# EAGLE design battery_monitor_6803-2_Rev6 (EAGLE 7.3.0)
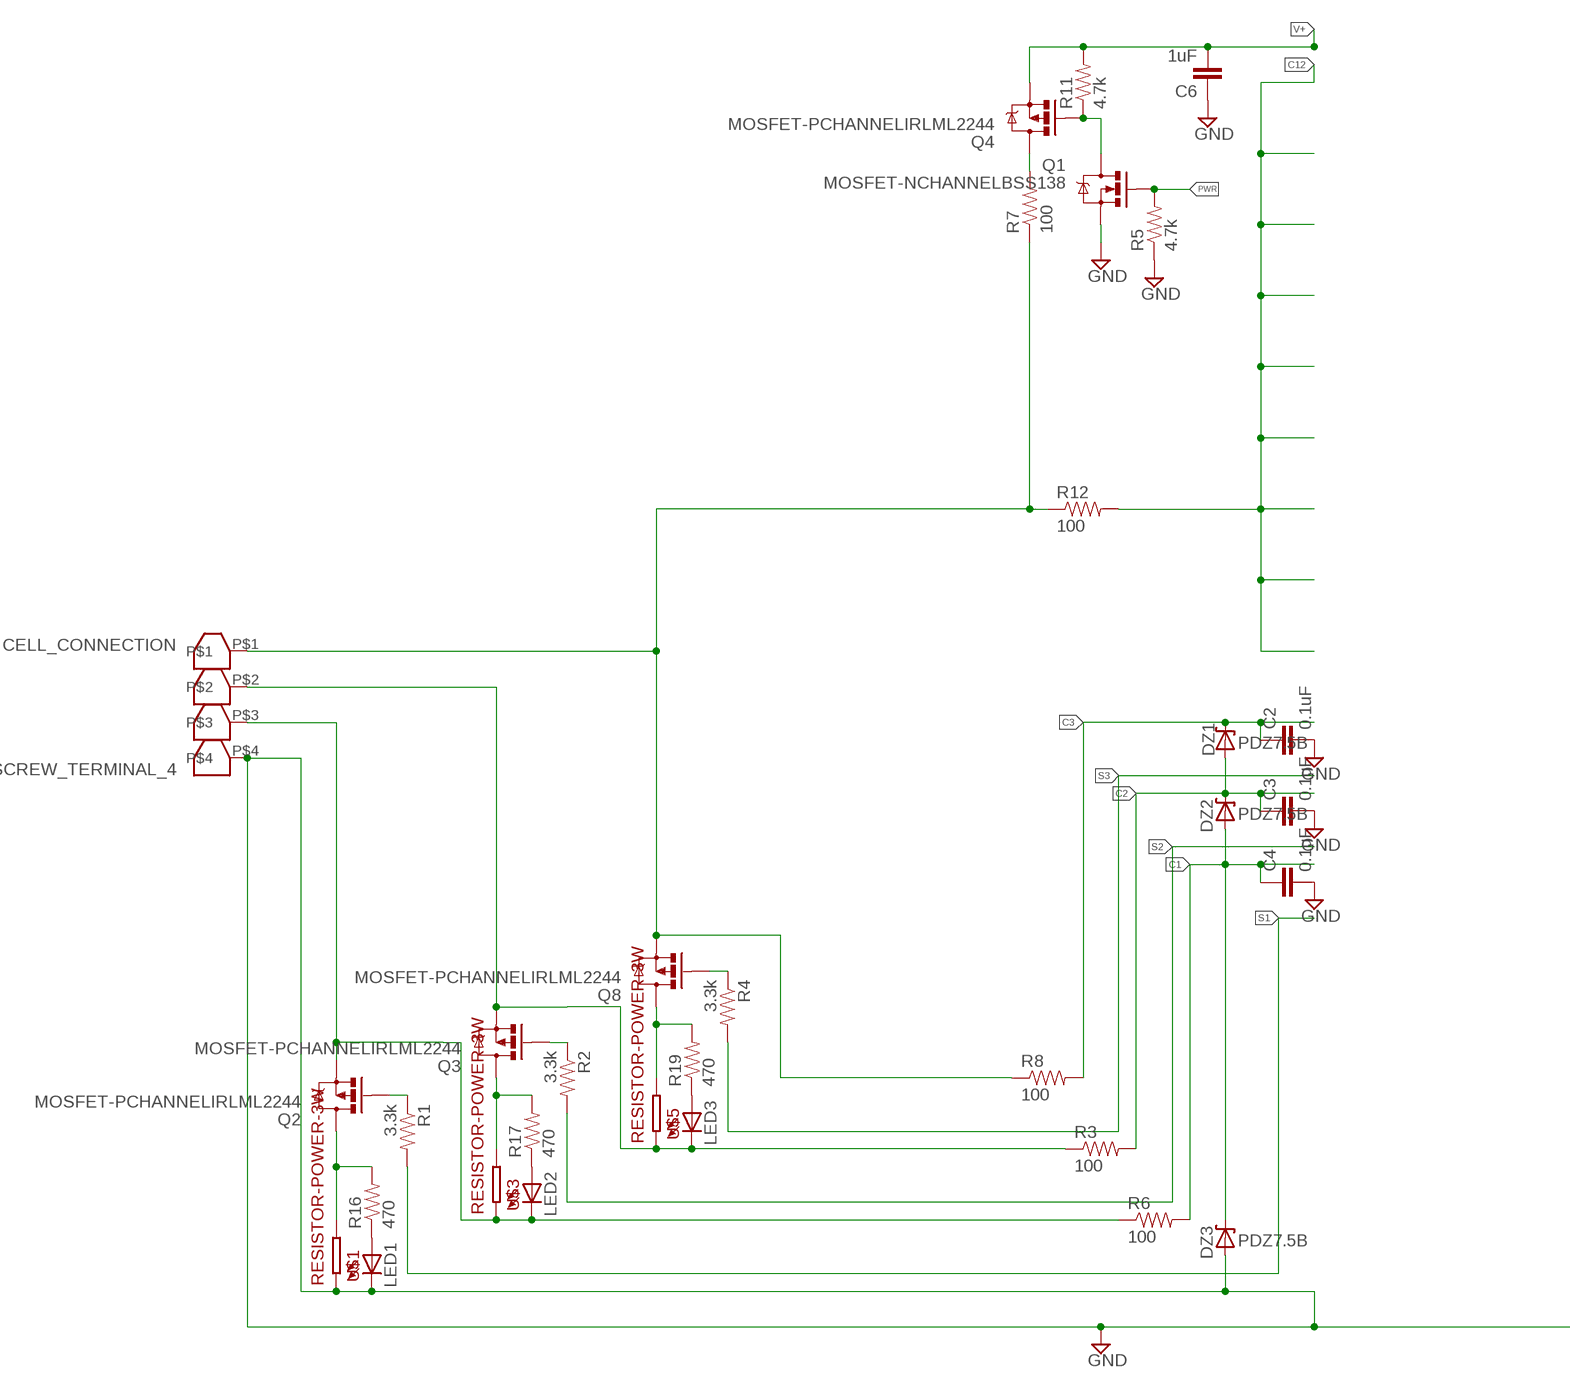
[diagram p0: schematic, sheet 1, part 1 of 2]
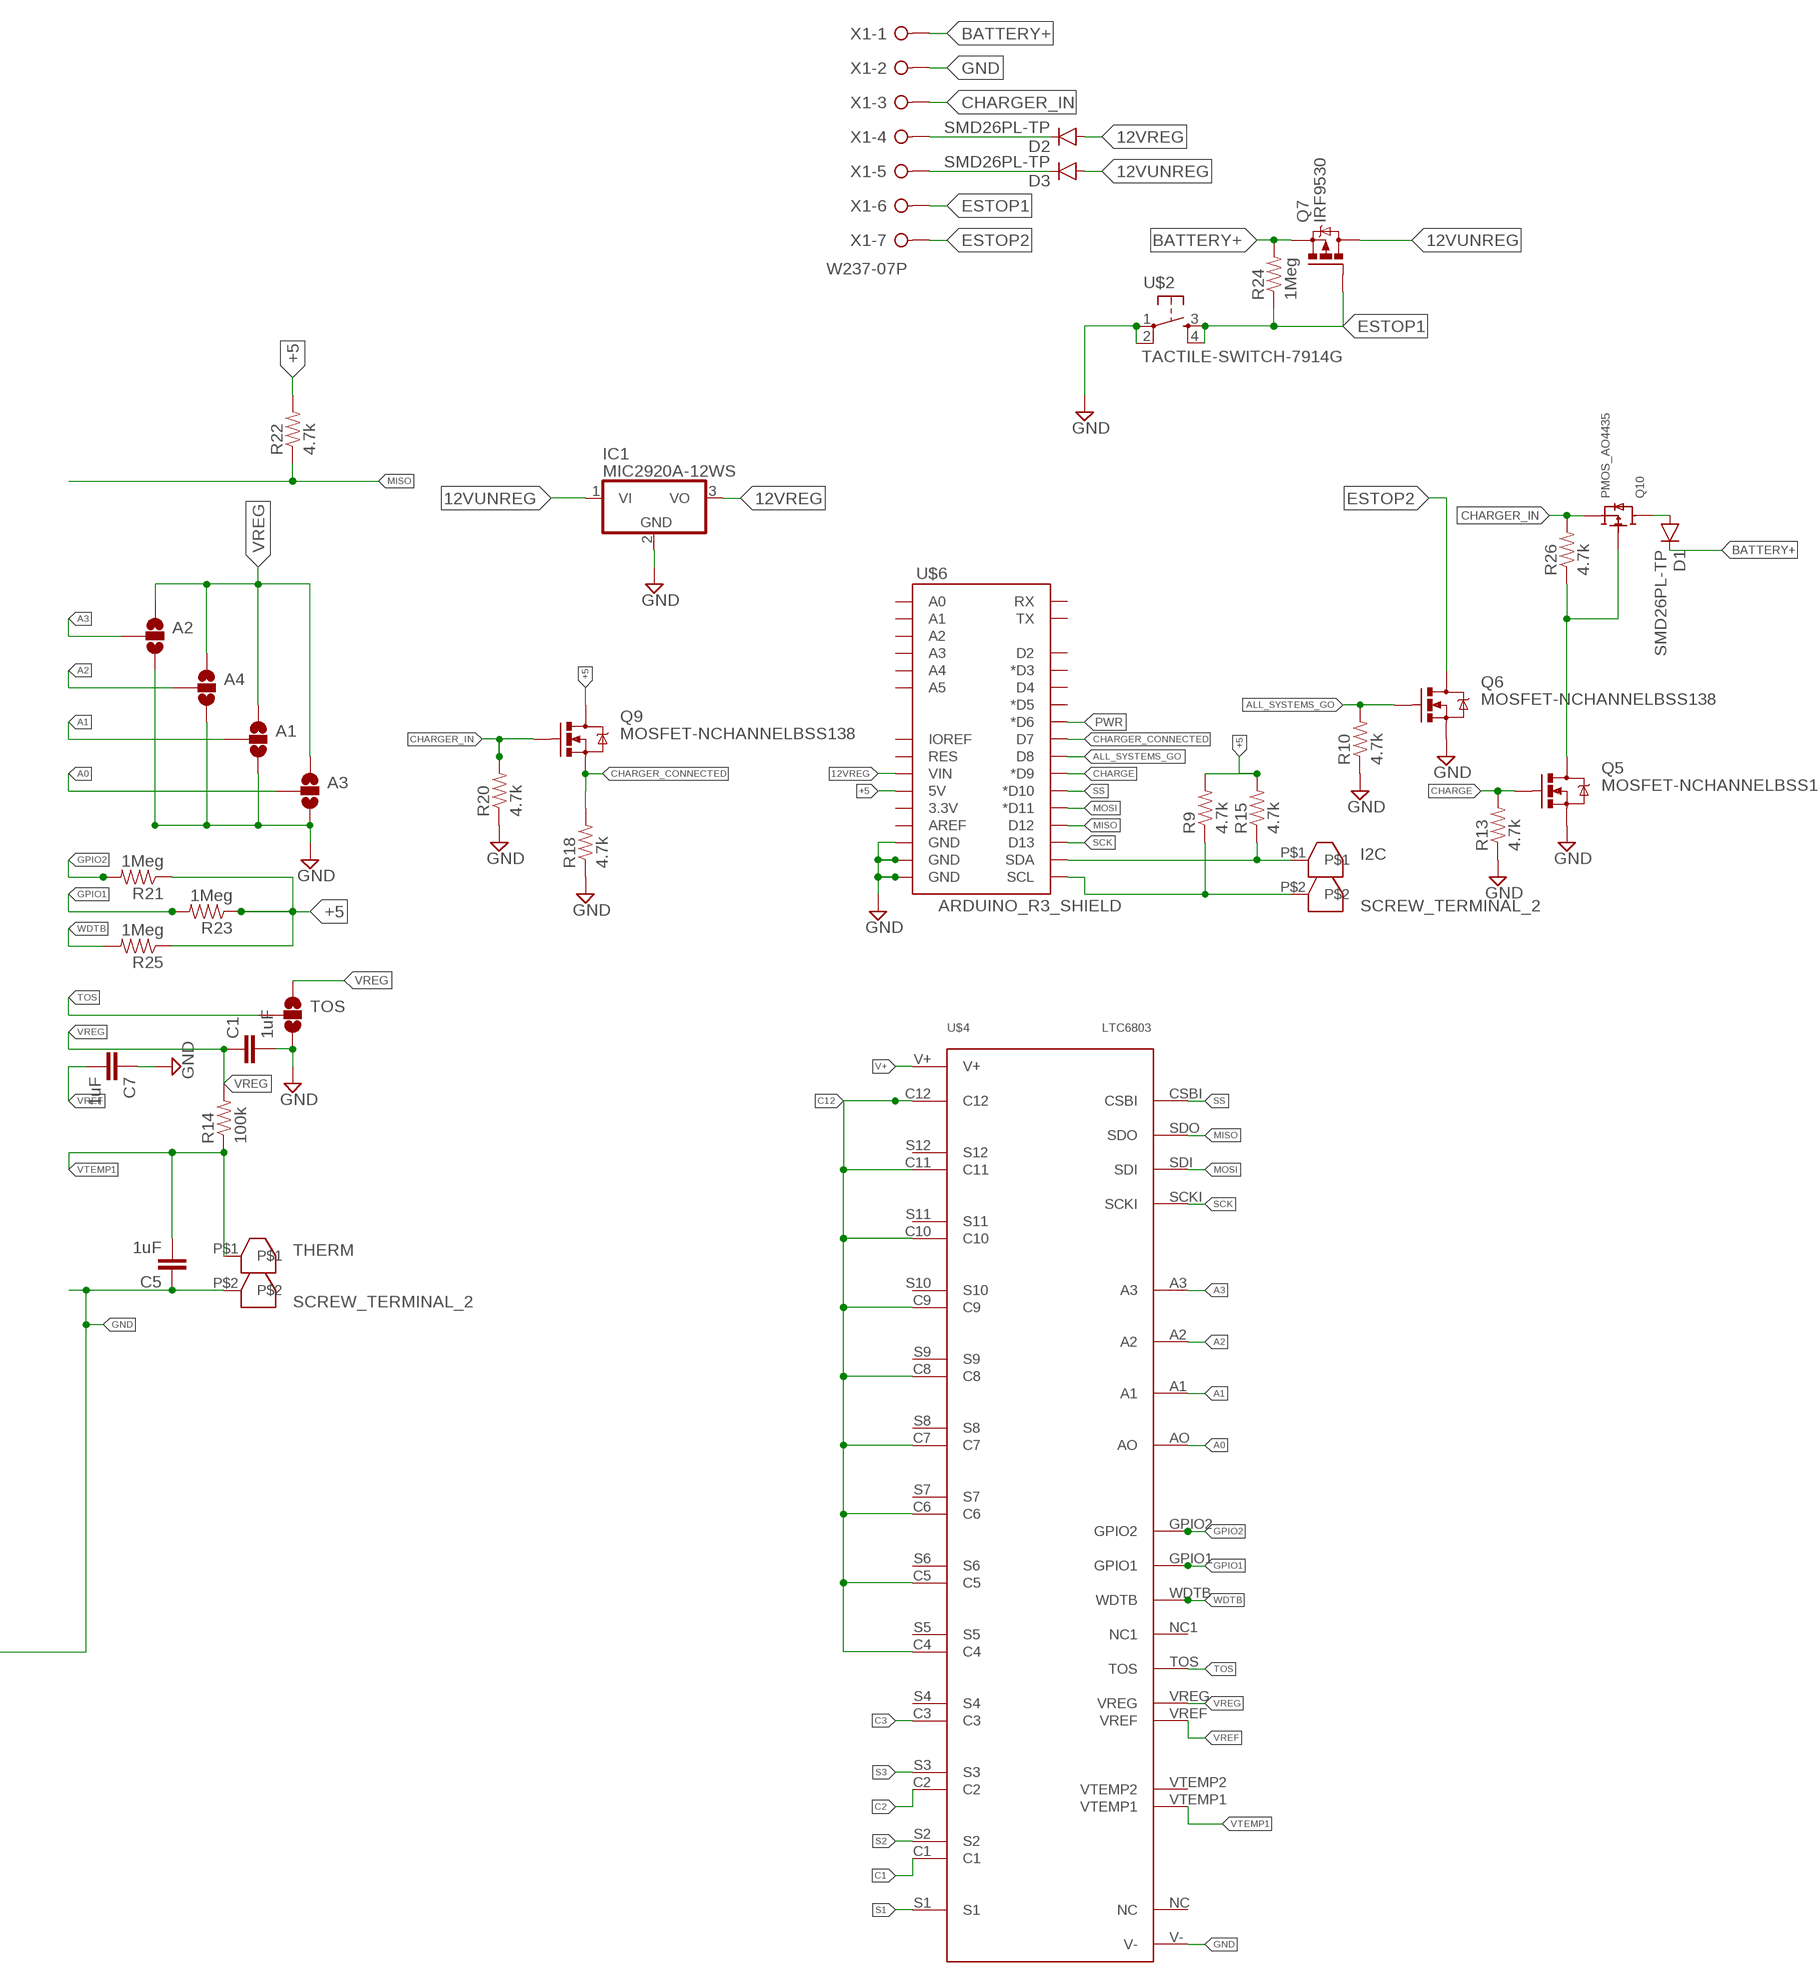
[diagram p1: schematic, sheet 1, part 2 of 2]

## Parts
A1  SOLDERJUMPER_2WAYS  [SJ_3]
A2  SOLDERJUMPER_2WAYS  [SJ_3]
A3  SOLDERJUMPER_2WAYS  [SJ_3]
A4  SOLDERJUMPER_2WAYS  [SJ_3]
C1  1uF  0.1UF-100V-10%(0603)  [0603-CAP]
C2  0.1uF  0.1UF-100V-10%(0603)  [0603-CAP]
C3  0.1uF  0.1UF-100V-10%(0603)  [0603-CAP]
C4  0.1uF  0.1UF-100V-10%(0603)  [0603-CAP]
C5  1uF  0.1UF-100V-10%(0603)  [0603-CAP]
C6  1uF  0.1UF-100V-10%(0603)  [0603-CAP]
C7  1uF  0.1UF-100V-10%(0603)  [0603-CAP]
CELL_CONNECTION  SCREW_TERMINAL_4  [SCREW_TERMINAL_4]
D1  SMD26PL-TP  DIODESOD123  [SOD-123]
D2  SMD26PL-TP  DIODESOD123  [SOD-123]
D3  SMD26PL-TP  DIODESOD123  [SOD-123]
DZ1  PDZ7.5B  DIODE-ZENER-BZT52  [SOD-323@1]
DZ2  PDZ7.5B  DIODE-ZENER-BZT52  [SOD-323@1]
DZ3  PDZ7.5B  DIODE-ZENER-BZT52  [SOD-323@1]
I2C  SCREW_TERMINAL_2  [SCREW_TERMINAL_2]
IC1  MIC2920A-12WS  MCP1703DB  [SOT223]
LED1  LED0603  [LED-0603]
LED2  LED0603  [LED-0603]
LED3  LED0603  [LED-0603]
Q1  MOSFET-NCHANNELBSS138  [SOT23]
Q2  MOSFET-PCHANNELIRLML2244  [SOT23-3@1]
Q3  MOSFET-PCHANNELIRLML2244  [SOT23-3@1]
Q4  MOSFET-PCHANNELIRLML2244  [SOT23-3@1]
Q5  MOSFET-NCHANNELBSS138  [SOT23]
Q6  MOSFET-NCHANNELBSS138  [SOT23]
Q7  IRF9530  [TO220BV]
Q8  MOSFET-PCHANNELIRLML2244  [SOT23-3@1]
Q9  MOSFET-NCHANNELBSS138  [SOT23]
Q10  PMOS_AO4435  [SOIC8]
R1  3.3k  3.3KOHM1/10W1%(0603)  [0603-RES]
R2  3.3k  3.3KOHM1/10W1%(0603)  [0603-RES]
R3  100  3.3KOHM1/10W1%(0603)  [0603-RES]
R4  3.3k  3.3KOHM1/10W1%(0603)  [0603-RES]
R5  4.7k  3.3KOHM1/10W1%(0603)  [0603-RES]
R6  100  3.3KOHM1/10W1%(0603)  [0603-RES]
R7  100  3.3KOHM1/10W1%(0603)  [0603-RES]
R8  100  3.3KOHM1/10W1%(0603)  [0603-RES]
R9  4.7k  3.3KOHM1/10W1%(0603)  [0603-RES]
R10  4.7k  3.3KOHM1/10W1%(0603)  [0603-RES]
R11  4.7k  3.3KOHM1/10W1%(0603)  [0603-RES]
R12  100  3.3KOHM1/10W1%(0603)  [0603-RES]
R13  4.7k  3.3KOHM1/10W1%(0603)  [0603-RES]
R14  100k  3.3KOHM1/10W1%(0603)  [0603-RES]
R15  4.7k  3.3KOHM1/10W1%(0603)  [0603-RES]
R16  470  3.3KOHM1/10W1%(0603)  [0603-RES]
R17  470  3.3KOHM1/10W1%(0603)  [0603-RES]
R18  4.7k  3.3KOHM1/10W1%(0603)  [0603-RES]
R19  470  3.3KOHM1/10W1%(0603)  [0603-RES]
R20  4.7k  3.3KOHM1/10W1%(0603)  [0603-RES]
R21  1Meg  3.3KOHM1/10W1%(0603)  [0603-RES]
R22  4.7k  3.3KOHM1/10W1%(0603)  [0603-RES]
R23  1Meg  3.3KOHM1/10W1%(0603)  [0603-RES]
R24  1Meg  3.3KOHM1/10W1%(0603)  [0603-RES]
R25  1Meg  3.3KOHM1/10W1%(0603)  [0603-RES]
R26  4.7k  3.3KOHM1/10W1%(0603)  [0603-RES]
THERM  SCREW_TERMINAL_2  [SCREW_TERMINAL_2]
TOS  SOLDERJUMPER_2WAYS  [SJ_3]
U$1  RESISTOR-POWER-3W  [RESISTOR-3W]
U$2  TACTILE-SWITCH-7914G  [7914G]
U$3  RESISTOR-POWER-3W  [RESISTOR-3W]
U$4  LTC6803  LTC6803_BREAKOUT  [LTC6803_BREAKOUT]
U$5  RESISTOR-POWER-3W  [RESISTOR-3W]
U$6  ARDUINO_R3_SHIELD  [UNO_R3_SHIELD]
X1  W237-07P  [W237-7P]

## Nets
12VREG: D2.A IC1.3(VO) U$6.VIN
12VUNREG: D3.A IC1.1(VI) Q7.D
+5: Q9.3(D) R9.2 R15.2 R21.1 R22.2 R23.1 R25.1 U$6.5V
A0: A3.2 U$4.AO
A1: A1.2 U$4.A1
A2: A4.2 U$4.A2
A3: A2.2 U$4.A3
ALL_SYSTEMS_GO: Q6.1(G) R10.2 U$6.D8
BATTERY+: D1.C Q7.S R24.2 X1.1
C1: C4.1 DZ2.2(A) DZ3.1(C) R6.2 U$4.C1
C2: C3.1 DZ1.2(A) DZ2.1(C) R3.2 U$4.C2
C3: C2.1 DZ1.1(C) R8.2 U$4.C3
C12: R12.2 U$4.C4 U$4.C5 U$4.C6 U$4.C7 U$4.C8 U$4.C9 U$4.C10 U$4.C11 U$4.C12
CHARGE: Q5.1(G) R13.2 U$6.D9(*D9)
CHARGER_CONNECTED: Q9.2(S) R18.2 U$6.D7
CHARGER_IN: Q9.1(G) Q10.1(SOURCE) Q10.2(SOURCE) Q10.3(SOURCE) R20.2 R26.2 X1.3
ESTOP1: Q7.G R24.1 U$2.3 U$2.4 X1.6
ESTOP2: Q6.3(D) X1.7
GND: A1.3 A2.3 A3.3 A4.3 C1.2 C2.2 C3.2 C4.2 C5.1 C6.1 C7.1 CELL_CONNECTION.P$4 DZ3.2(A) IC1.2(GND) LED1.C Q1.2(S) Q5.2(S) Q6.2(S) R5.1 R10.1 R13.1 R18.1 R20.1 THERM.P$2 TOS.3 U$1.P$2 U$2.1 U$2.2 U$4.V- U$6.GND@0(GND) U$6.GND@1(GND) U$6.GND@2(GND) X1.2
GPIO1: R23.2 U$4.GPIO1
GPIO2: R21.2 U$4.GPIO2
MISO: R22.1 U$4.SDO U$6.D12
MOSI: U$4.SDI U$6.D11(*D11)
N$1: Q5.3(D) Q10.4(GATE) R26.1
N$2: CELL_CONNECTION.P$3 LED2.C Q2.2(S) R6.1 U$3.P$2
N$3: CELL_CONNECTION.P$2 LED3.C Q3.2(S) R3.1 U$5.P$2
N$4: CELL_CONNECTION.P$1 Q8.2(S) R7.1 R8.1 R12.1
N$5: Q2.3(D) R16.2 U$1.P$1
N$7: Q2.1(G) R1.1
N$8: D1.A Q10.5(DRAIN) Q10.6(DRAIN) Q10.7(DRAIN) Q10.8(DRAIN)
N$10: Q3.3(D) R17.2 U$3.P$1
N$11: Q3.1(G) R2.1
N$12: Q8.3(D) R19.2 U$5.P$1
N$13: LED1.A R16.1
N$15: D2.C X1.4
N$16: D3.C X1.5
N$18: Q4.3(D) R7.2
N$20: Q1.3(D) Q4.1(G) R11.1
N$22: LED2.A R17.1
N$23: LED3.A R19.1
N$29: Q8.1(G) R4.1
PWR: Q1.1(G) R5.2 U$6.D6(*D6)
S1: R1.2 U$4.S1
S2: R2.2 U$4.S2
S3: R4.2 U$4.S3
SCK: U$4.SCKI U$6.D13
SCL: I2C.P$2 R9.1 U$6.SCL
SDA: I2C.P$1 R15.1 U$6.SDA
SS: U$4.CSBI U$6.D10(*D10)
TOS: TOS.2 U$4.TOS
V+: C6.2 Q4.2(S) R11.2 U$4.V+
VREF: C7.2 U$4.VREF
VREG: A1.1 A2.1 A3.1 A4.1 C1.1 R14.2 TOS.1 U$4.VREG
VTEMP1: C5.2 R14.1 THERM.P$1 U$4.VTEMP1
WDTB: R25.2 U$4.WDTB
Unconnected: U$4.NC U$4.NC1 U$4.S4 U$4.S5 U$4.S6 U$4.S7 U$4.S8 U$4.S9 U$4.S10 U$4.S11 U$4.S12 U$4.VTEMP2 U$6.3.3V U$6.A0 U$6.A1 U$6.A2 U$6.A3 U$6.A4 U$6.A5 U$6.AREF U$6.D2 U$6.D3(*D3) U$6.D4 U$6.D5(*D5) U$6.IOREF U$6.RES U$6.RX U$6.TX

## Library data of the parts
A1-A4 TOS = SparkFun:SOLDERJUMPER_2WAY: Solder Jumper 2 way solder jumper; OC_NEWARK: unknown
C1 C5-C7 = SparkFun-Capacitors:0.1UF-100V-10%(0603): CAP-08390; MPN: C0603X5R0J105M030BC; OC_NEWARK: 04X3184; PROD_ID: CAP-08390; VALUE: 0.1uF
C2-C4 = SparkFun-Capacitors:0.1UF-100V-10%(0603): CAP-08390; MF: AVX CORPORATION; MPN: 0603YG104ZAT2A; OC_NEWARK: 01H6821; PROD_ID: CAP-08390
CELL_CONNECTION = isaac1:SCREW_TERMINAL_4; MF: TYCO ELECTRONICS; MPN: 282834-4; OC_NEWARK: 12H8388
D1-D3 = SparkFun-DiscreteSemi:DIODE: Diode These are standard reverse protection diodes and small signal diodes. SMA package can handle up to about 1A. SOD-323 can handle about 200mA. What the SOD-323 package when ordering, there are some mfgs out there that are 5-pin packages.
DZ1-DZ3 = SparkFun-DiscreteSemi:DIODE-ZENER: Zener Diode Production Part - 8199 3.4V Zener Voltage; MPN: PDZ7.5B,115; OC_NEWARK: 04X4941
I2C THERM = isaac1:SCREW_TERMINAL_2; MF: TYCO ELECTRONICS; MPN: 282834-2; OC_NEWARK: 12H8386
IC1 = linear:MCP1703: 250 mA, 16V, Low Quiescent Current LDO Regulator Source: http://ww1.microchip.com/downloads/en/DeviceDoc/22049b.pdf
LED1-LED3 = SparkFun-LED:LED: LEDs Standard schematic elements and footprints for 5mm, 3mm, 1206, and 0603 sized LEDs. 5mm - Spark Fun Electronics SKU : COM-00529 (and others); MPN: 150060RS75000; OC_NEWARK: 95W3795
Q1 Q5 Q6 Q9 = SparkFun-DiscreteSemi:MOSFET-NCHANNEL: Common NMOSFET Parts MFG P/N Store ID Prod ID FDD8780 TRANS-09984 SI7820DN TRANS-11055 FDS6630A IC-08089 2N7002PW TRANS-11151 FQP30N06L COM-10213 TRANS-10060 BSS123LT1G TRANS-08345 BSS138 TRANS-00830 BS170 2N7000; MPN: IRLML0030TRPBF; OC_NEWARK: 52R2613; PROD_ID: TRANS-00830
Q2-Q4 Q8 = SparkFun-DiscreteSemi:MOSFET-PCHANNEL: Generic PMOSFET; MPN: IRLML2244TRPBF; OC_NEWARK: 40T7448; PROD_ID: TRANS-11153
Q7 = Adams Chips:IRF9530: P-CHANNEL HEXFET POWER-MOS-FET Source: http://www.irf.com/product-info/datasheets/data/irf9530.pdf; MPN: NTE2383; OC_NEWARK: 14T4215
Q10 = isaac1:PMOS_AO4435; MPN: SI9407BDY-T1-GE3; OC_NEWARK: 16P3885
R1 R2 R4 = SparkFun-Resistors:3.3KOHM1/10W1%(0603): RES-07851; MF: VISHAY/DALE; MPN: CRCW06033K00FKEA; OC_NEWARK: 52K8368; PROD_ID: RES-07851
R3 R6-R8 R12 = SparkFun-Resistors:3.3KOHM1/10W1%(0603): RES-07851; MPN: ERJ-1GNF1000C; OC_NEWARK: 05X8794; PROD_ID: RES-07851
R5 R9-R11 R13 R15 R18 R20 R22 R26 = SparkFun-Resistors:3.3KOHM1/10W1%(0603): RES-07851; MF: VISHAY/DALE; MPN: CRCW06034K70FKEA; OC_NEWARK: 52K8494; PROD_ID: RES-07851
R14 = SparkFun-Resistors:3.3KOHM1/10W1%(0603): RES-07851; MF: FARNELL; MPN: MC0063W06035100K; OC_NEWARK: 39K0075; PROD_ID: RES-07851
R16 R17 R19 = SparkFun-Resistors:3.3KOHM1/10W1%(0603): RES-07851; MPN: ERJ-P03F4700V; OC_NEWARK: 05X8640; PROD_ID: RES-07851
R21 R23-R25 = SparkFun-Resistors:3.3KOHM1/10W1%(0603): RES-07851; MPN: ERJ-3EKF1004V; OC_NEWARK: 64R5311; PROD_ID: RES-07851
U$1 U$3 U$5 = isaac1:RESISTOR-POWER-3W: PR03 series .205" dia x .657" L; MPN: ERG-3SJ200; OC_NEWARK: 52W7905
U$2 = GeekAmmo:TACTILE-SWITCH: Tactile Switch 4 Pins, SPST NO; MF: BOURNS, INC.; MPN: 7914G-1-000E; OC_NEWARK: 05B2757
U$4 = Clayton:LTC6803_BREAKOUT; MPN: LTC6803IG-2#PBF; OC_NEWARK: 27T5837
U$6 = SparkFun-Boards:ARDUINO_R3_SHIELD: Shield form compatible with the Arduino Uno R3.; OC_NEWARK: unknown
X1 = con-wago-508:W237-07P: WAGO SREW CLAMP; OC_FARNELL: unknown; OC_NEWARK: unknown

## Board
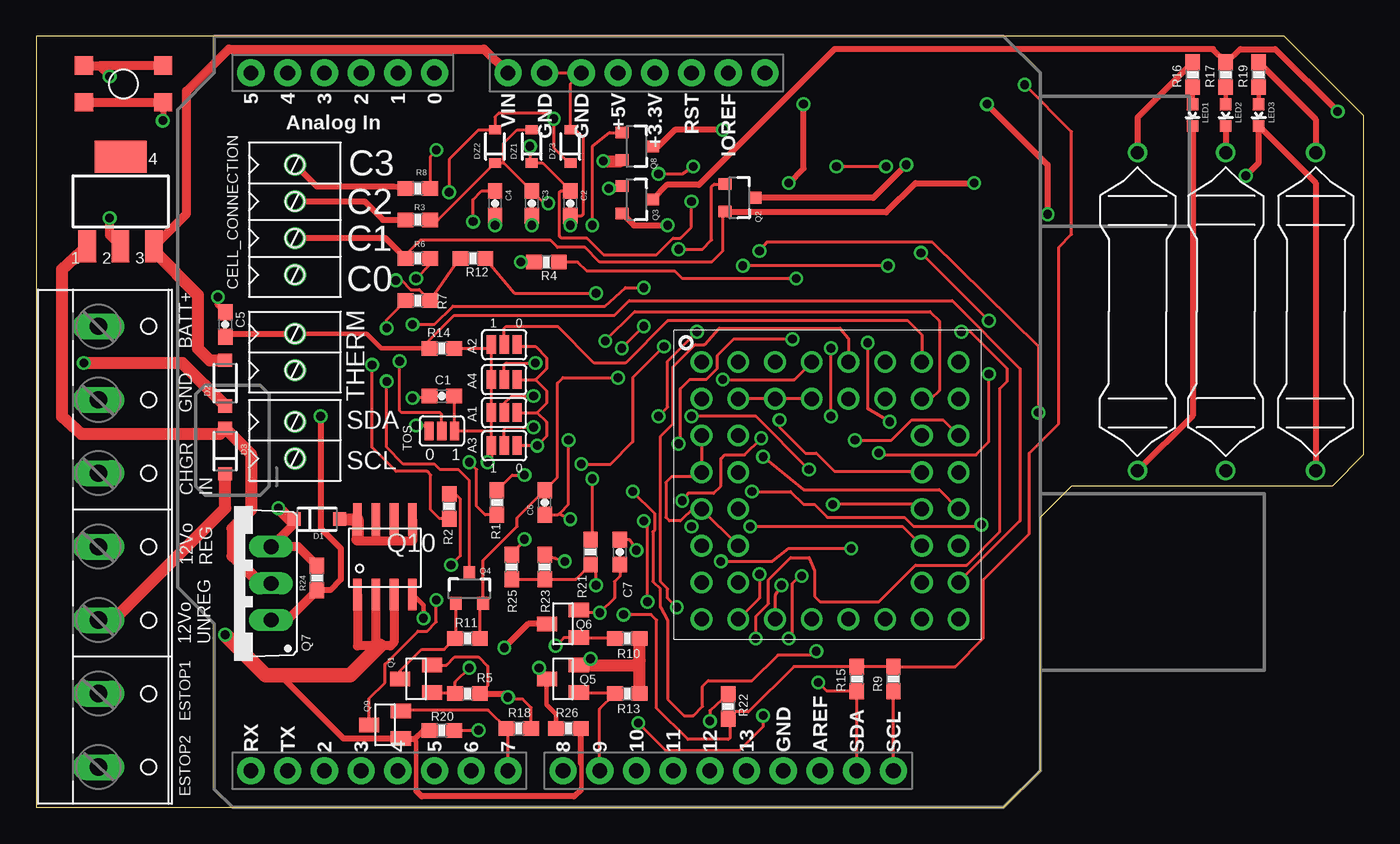
[diagram p2: board, top side]
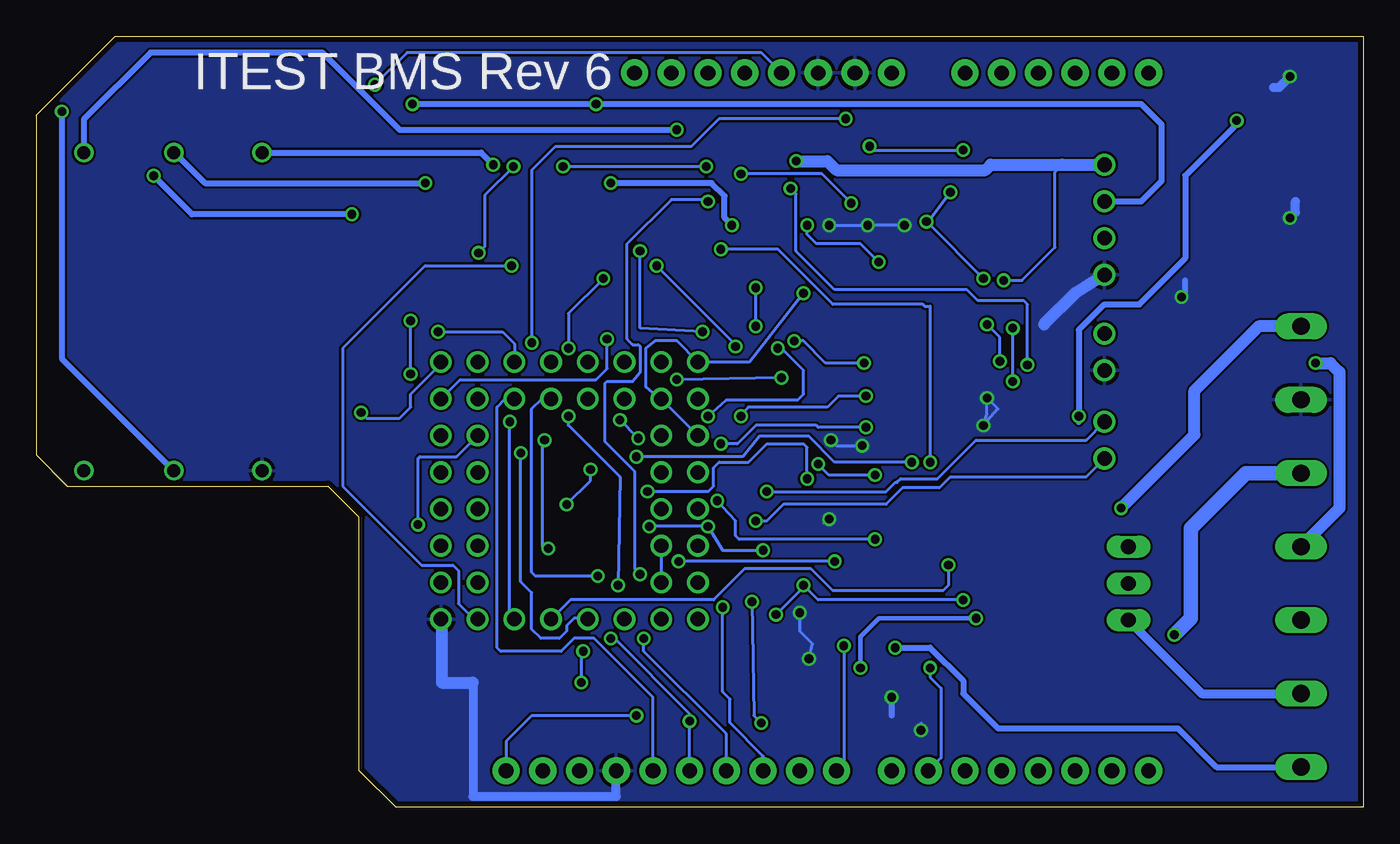
[diagram p3: board, bottom side, seen from below]

Size 91.82 x 53.34 mm. Coordinates in mm from the lower left corner, seen from the top.
Outline: 0,0 66.93,0 69.47,2.54 69.47,20.07 71.63,22.22 89.66,22.22 91.82,24.38 91.82,47.88 86.36,53.34 0,53.34 0,0
Copper layers (1*16): Top 0.0356mm / dielectric 1.5011mm / Bottom 0.0356mm
Design rules "LaenPCBOrder": minimum track width 6mil, minimum drill 13mil, track to track 6mil, track to pad 6mil, pad to pad 6mil, via to via 6mil, smd to smd 6mil, copper to edge 15mil, drill to drill 6mil, minimum pad ring 7mil, minimum via ring 7mil, stop-mask expansion 3mil, vias tented up to drill 0mil, thermal gap 10mil

### Footprints (pad centres in the part's own frame; a part is rotated, then mirrored left to right if it is on the bottom)
SJ_3 = smd 0.635 x 1.27: 1 -0.889,0; 2 0,0; 3 0.889,0
0603-CAP = smd 1.1 x 1: 1 -0.85,0; 2 0.85,0
SCREW_TERMINAL_4 = drill 1.016 pad 1.422: P$1 0,3.81; P$2 0,1.27; P$3 0,-1.27; P$4 0,-3.81
SOD-123 = smd 0.9 x 0.95: A 1.575,0; C -1.575,0
SOD-323@1 = smd 0.63 x 0.83: 1 -1.15,0; 2 1.15,0
SCREW_TERMINAL_2 = drill 1.016 pad 1.422: P$1 0,1.27; P$2 0,-1.27
SOT223 = smd 1.219 x 2.235: 1 -2.311,-3.099; 2 0,-3.099; 3 2.311,-3.099 | smd 3.6 x 2.2: 4 0,3.099
LED-0603 = smd 0.8 x 0.8: A 0,-0.75; C 0,0.75
SOT23 = smd 1 x 1.4: 1 -0.95,-1.1; 2 0.95,-1.1; 3 0,1.1
SOT23-3@1 = smd 0.8 x 0.9: 1 -0.95,-1; 2 0.95,-1; 3 0,1.1
TO220BV = drill 1.016 long: D 0,-2.54; G -2.54,-2.54; S 2.54,-2.54
SOIC8 = smd 0.6 x 2.2: 1 -1.905,-2.54; 2 -0.635,-2.54; 3 0.635,-2.54; 4 1.905,-2.54; 5 1.905,2.66; 6 0.635,2.66; 7 -0.635,2.66; 8 -1.905,2.66
0603-RES = smd 1.1 x 1: 1 -0.85,0; 2 0.85,0
RESISTOR-3W = drill 0.9: P$1 0,11; P$2 0,-11
7914G = smd 1.27 x 1.27: 1 0,0; 2 0,5.486; 3 2.54,0; 4 2.54,5.486
LTC6803_BREAKOUT = drill 1: A1 19.748,19.241; A2 17.209,16.701; A3 17.209,19.241; AO 19.748,16.701; C1 14.668,1.46; C2 9.588,1.46; C3 4.508,1.46; C4 4.508,4; C5 4.508,6.54; C6 1.968,9.081; C7 1.968,11.62; C8 1.968,14.161; C9 1.968,19.241; C10 4.508,16.701; C11 7.048,16.701; C12 9.588,16.701; CSBI 12.129,19.241; GPIO1 19.748,14.161; GPIO2 17.209,14.161; NC 17.209,4; NC1 19.748,11.62; S1 17.209,1.46; S2 12.129,1.46; S3 7.048,1.46; S4 1.968,1.46; S5 1.968,4; S6 1.968,6.54; S7 4.508,9.081; S8 4.508,11.62; S9 4.508,14.161; S10 1.968,16.701; S11 4.508,19.241; S12 7.048,19.241; SCKI 14.668,16.701; SDI 14.668,19.241; SDO 12.129,16.701; TOS 17.209,9.081; V+ 9.588,19.241; V- 19.748,1.46; VREF 17.209,6.54; VREG 19.748,9.081; VTEMP1 19.748,4; VTEMP2 19.748,6.54; WDTB 17.209,11.62
UNO_R3_SHIELD = drill 1.016 pad 1.88: 3.3V 50.8,26.67; 5V 50.8,29.21; A0 50.8,41.91; A1 50.8,44.45; A2 50.8,46.99; A3 50.8,49.53; A4 50.8,52.07; A5 50.8,54.61; AREF 2.54,15.24; D2 2.54,49.53; D3 2.54,46.99; D4 2.54,44.45; D5 2.54,41.91; D6 2.54,39.37; D7 2.54,36.83; D8 2.54,33.02; D9 2.54,30.48; D10 2.54,27.94; D11 2.54,25.4; D12 2.54,22.86; D13 2.54,20.32; GND@0 50.8,31.75; GND@1 50.8,34.29; GND@2 2.54,17.78; IOREF 50.8,21.59; NC 50.8,19.05; RES 50.8,24.13; RX 2.54,54.61; SCL 2.54,10.16; SDA 2.54,12.7; TX 2.54,52.07; VIN 50.8,36.83
W237-7P = drill 1.194 long: 1 -15.24,-0.635; 2 -10.16,-0.635; 3 -5.08,-0.635; 4 0,-0.635; 5 5.08,-0.635; 6 10.16,-0.635; 7 15.24,-0.635

### Placement (x,y rotation side)
A1  32.38,27.3 0 top
A2  32.38,32 0 top
A3  32.38,25.02 0 top
A4  32.38,29.59 0 top
C1  28.07,28.45 180 top
C2  36.96,41.78 270 top
C3  34.29,41.78 270 top
C4  31.75,41.78 270 top
C5  13.08,33.4 270 top
C6  35.18,21.08 90 top
C7  40.39,17.65 90 top
CELL_CONNECTION  17.91,40.64 0 top
D1  19.43,19.94 0 top
D2  13.08,29.34 90 top
D3  13.08,24.64 90 top
DZ1  34.29,45.72 90 top
DZ2  31.75,45.72 90 top
DZ3  36.96,45.72 90 top
I2C  17.91,25.4 0 top
IC1  5.84,41.91 0 top
LED1  80.01,47.88 180 top
LED2  82.3,47.88 180 top
LED3  84.58,47.88 180 top
Q1  26.29,8.89 90 top
Q2  48.64,42.16 270 top
Q3  41.53,42.04 270 top
Q4  29.97,15.11 0 top
Q5  36.45,8.89 90 top
Q6  36.45,12.7 90 top
Q7  13.72,15.49 90 top
Q8  41.53,45.72 270 top
Q9  24.13,5.71 90 top
Q10  24.13,17.27 0 top
R1  31.88,21.08 90 top
R2  28.57,20.83 90 top
R3  26.42,40.64 0 top
R4  35.31,37.72 0 top
R5  29.84,7.87 180 top
R6  26.42,37.97 0 top
R7  26.42,35.05 180 top
R8  26.42,42.8 0 top
R9  59.31,8.89 90 top
R10  40.89,11.68 180 top
R11  29.84,11.68 0 top
R12  30.23,37.97 0 top
R13  40.89,7.87 180 top
R14  28.07,31.75 0 top
R15  56.77,8.89 90 top
R16  80.01,50.67 90 top
R17  82.3,50.67 90 top
R18  33.4,5.46 180 top
R19  84.58,50.67 90 top
R20  28.07,5.33 180 top
R21  38.35,17.65 90 top
R22  47.88,6.98 270 top
R23  35.18,16.64 90 top
R24  19.43,15.88 90 top
R25  32.89,16.64 90 top
R26  36.83,5.46 0 top
THERM  17.91,31.5 0 top
TOS  28.07,26.04 180 top
U$1  76.2,34.29 0 top
U$2  3.3,51.31 270 top
U$3  82.3,34.29 180 top
U$4  44.07,11.56 0 top
U$5  88.52,34.29 0 top
U$6  69.47,0 90 top
X1  4.95,18.03 270 top

### Tracks (layer width: path | path; a pad name or v marks a point on that pad's centre or on a via)
12VREG
  Top 0.61: IC1.3 10.41,41.07 10.41,49.53 13.34,52.45 30.99,52.45 U$6.VIN
  Top 0.813: IC1.3 8.15,38.46 11.18,35.43 11.18,31.75 12.01,30.91 D2.A
12VUNREG
  Top 0.813: Q7.D 15.49,15.49 13.59,17.4 13.59,19.3 14.86,20.57 14.86,24.43 D3.A 12.7,25.83 3.12,25.83 1.78,27.05 1.78,37.19 IC1.1
+5  (via drill 0.6)
  Top 0.203: R9.2 R15.2 52.41,9.74 49.28,6.6 48.35,6.6 R22.2 48.01,6.01 48.01,4.83 47.88,4.7 45.09,4.7 42.93,6.86 42.93,12.95 42.55,13.33 v40.64,13.33 | Q9.3 23.03,7.54 24.13,8.64 24.13,9.91 26.42,12.19 27.05,12.19 27.69,12.83 v27.69,14.35 | v38.73,15.37 38.73,16.42 R21.1 37.34,15.79 R23.1 R25.1 | R9.2 59.35,9.78 | v68.39,49.97 71.63,46.74 71.63,39.62 70.74,38.73 70.74,26.54 68.71,24.51 68.71,18.92 65.53,15.75 65.53,11.68 63.59,9.74 R9.2
  Bottom 0.203: v27.69,14.35 37.72,14.35 v38.73,15.37 38.73,15.24 v40.64,13.33 | U$6.5V 41.66,52.2 66.17,52.2 v68.39,49.97
A0  (via drill 0.6)
  Top 0.203: A3.2 32.38,26.16 32.51,26.29 v34.42,26.29 | v52.32,32.38 48.26,32.38 47.12,31.24 47.12,30.35 46.35,29.59 45.21,29.59 44.58,28.96 44.58,25.27 v44.45,25.15
  Bottom 0.203: v34.42,26.29 37.72,26.29 37.85,26.42 42.04,26.42 43.31,25.15 v44.45,25.15 | U$4.AO 62.48,29.59 53.09,29.59 52.32,30.35 v52.32,32.38
A1  (via drill 0.6)
  Top 0.203: A1.2 32.38,27.94 32.89,28.45 v34.42,28.45 | v43.05,27.05 43.69,27.69 43.69,30.86 v45.72,32.89 | v50.04,38.48 50.55,39.12 61.98,39.12 69.34,31.88 v69.34,27.3
  Bottom 0.203: v34.42,28.45 36.32,28.45 37.08,27.69 42.55,27.69 43.05,27.18 v43.05,27.05 | v45.72,32.89 50.04,33.15 v50.04,38.48 | v69.34,27.3 68.96,26.92 66.68,26.92 65.91,27.69 65.91,28.57 63.82,30.67 U$4.A1
A2  (via drill 0.6)
  Top 0.203: A4.2 32.38,30.61 32.51,30.73 v34.54,30.73 | v39.37,32.26 41.4,34.29 61.85,34.29 62.48,33.66 62.48,28.83 61.91,28.26 U$4.A2
  Bottom 0.203: v34.54,30.73 37.21,30.73 38.73,32.26 v39.37,32.26
A3
  Top 0.203: U$4.A3 61.28,32.7 60.32,33.66 43.69,33.66 40.77,30.73 38.61,30.73 36.07,33.27 32.51,33.27 32.38,33.15 A2.2
ALL_SYSTEMS_GO  (via drill 0.6)
  Top 0.203: 39.98,11.75 Q6.1 36.52,11.75 v35.94,11.18
  Top 0.813: 39.98,11.75 R10.2
  Bottom 0.203: v35.94,11.18 35.94,3.05 U$6.D8
BATTERY+  (via drill 0.6)
  Top 0.61: R24.2 18.12,18.03 Q7.S 17.86,19.63 D1.C
  Top 0.813: D1.C 17.53,19.94 v16.76,20.7
  Bottom 0.813: v16.76,20.7 11.68,25.78 11.68,28.83 7.24,33.27 X1.1
C1  (via drill 0.6)
  Top 0.203: DZ3.1 36.84,44.57 35.81,45.59 v35.81,47.62 35.81,47.75 35.56,48.01 32,48.01 31.75,47.75 DZ2.2 30.61,46.86 28.57,44.83 v28.57,42.55 | 31.41,42.63 C4.1 30.82,42.63 30.23,42.04 v30.23,40.51 | v59.05,26.67 57.53,27.56 v57.53,32.13 | R6.2 27.27,37.55 v26.29,36.58
  Bottom 0.203: v28.57,42.55 30.1,40.51 | U$4.C1 59.05,13.33 v59.05,26.67 | v57.53,32.13 57.53,44.07 55.88,45.72 46.48,45.72 44.58,47.62 v35.81,47.62 | 30.1,40.51 v30.23,40.51 | 30.1,40.51 30.1,40.39 v26.29,36.58
C2  (via drill 0.6)
  Top 0.203: 32.35,44.57 DZ2.1 27.82,40.64 R3.2 | 32.35,44.57 C3.1 35.14,41.78 v35.43,41.78 | 32.35,44.57 32.35,45.94 33.27,46.86 DZ1.2 | v43.05,43.81 44.7,43.81 v45.47,44.32 | v58.29,24.51 58.42,24.38 65.02,24.38 65.91,25.27 v65.91,29.97 | v61.21,38.35 v65.91,33.66 | v58.8,44.32 v55.37,44.32
  Bottom 0.203: v35.43,41.78 37.46,43.81 v43.05,43.81 | U$4.C2 53.72,13.08 54.61,13.08 55.12,12.57 55.12,12.19 55.63,11.68 56.9,11.68 57.53,12.32 57.53,14.86 58.29,15.62 v58.29,24.51 | v65.91,29.97 v65.91,33.66 | v45.47,44.32 v55.37,44.32 | v58.8,44.32 60.77,42.35 60.77,38.8 v61.21,38.35
C3  (via drill 0.6)
  Top 0.203: v34.16,45.72 34.16,44.7 DZ1.1 35.02,44.57 C2.1 36.28,42.63 36.2,42.55 36.2,39.5 36.32,39.37 38.1,39.37 39.24,38.23 42.93,38.23 44.07,39.37 44.58,39.37 45.34,40.13 v45.34,41.91 | v50.04,16.13 50.04,14.48 U$4.C3 | v27.69,45.47 27.27,45 R8.2
  Bottom 0.203: v45.34,41.91 45.47,42.04 47.88,42.04 50.93,38.99 50.93,32.38 50.55,32 50.16,32 50.04,31.88 50.04,30.1 50.55,29.46 52.32,29.46 52.45,29.34 52.45,25.27 50.42,23.24 50.42,16.51 v50.04,16.13 | v34.16,45.72 33.91,45.47 v27.69,45.47
C12  (via drill 0.6)
  Top 0.203: R12.2 33.11,35.56 v38.73,35.56 | U$4.C8 U$4.C7 45.72,22.86 43.94,22.86 43.56,22.48 43.56,20.07 43.81,19.81 44.58,19.81 45.47,20.7 45.97,20.7 U$4.C6 U$4.C5 | U$4.C12 U$4.C11 U$4.C10
  Bottom 0.203: v38.73,35.56 42.48,30.8 U$4.C9 47.5,32.26 49.02,32.26 49.66,31.75 49.66,29.08 48.7,28.26 U$4.C10 U$4.C8 | U$4.C5 U$4.C4
CHARGE
  Top 0.203: Q5.1 39.98,7.94 R13.2 38.99,6.82 U$6.D9
CHARGER_CONNECTED
  Top 0.203: U$6.D7 32.64,5.37 R18.2 31.28,6.73 25.3,6.73 Q9.2
CHARGER_IN  (via drill 0.6)
  Top 0.203: R20.2 26.8,5.33 | 25.3,4.7 Q9.1 | 37.68,3.09 37.72,3.05 | 26.29,4.57 26.16,4.7
  Top 0.305: 37.72,3.05 37.72,1.27 | 26.29,1.14 26.29,4.57
  Top 0.406: 26.8,5.33 26.16,4.7 25.3,4.7 | R26.2 37.68,3.09 | 37.72,1.27 37.21,0.76 26.67,0.76 26.29,1.14 | Q9.1 21.27,4.77 16.89,9.14
  Top 0.61: Q10.1 22.22,11.18 23.24,11.18 | Q10.2 23.49,11.43 23.24,11.18 | Q10.3 24.77,11.43 24.51,11.18 23.75,11.18 23.24,11.18
  Top 1.016: 23.75,11.18 21.72,9.14 16.89,9.14 15.88,9.14 v13.08,11.94
  Bottom 1.016: v13.08,11.94 11.94,13.08 11.94,19.3 8.13,23.11 X1.3
ESTOP1  (via drill 0.6)
  Top 0.406: U$2.4 8.79,47.52 v8.76,47.5 | v19.68,27.05 19.68,19.3 21.08,17.91 21.08,15.75 20.36,15.03 R24.1
  Top 0.61: R24.1 17.36,12.95 Q7.G | U$2.3 U$2.4
  Bottom 0.406: v8.76,47.5 8.76,47.24 12.32,43.69 12.32,37.97 15.49,34.8 17.91,34.8 19.68,33.02 v19.68,27.05 19.68,26.67
  Bottom 0.61: Q7.G 11.18,7.87 X1.6
ESTOP2  (via drill 0.6)
  Top 0.406: Q6.3 34.04,12.7 v32.38,11.05
  Bottom 0.406: v32.38,11.05 29.97,11.05 27.69,8.76 27.69,7.87 25.27,5.46 12.83,5.46 10.16,2.79 X1.7
GND  (via drill 0.6)
  Top 0.203: C4.2 v31.75,40.26 | v34.29,40.26 C3.2 | v36.96,40.26 C2.2 37,40.89 37.72,40.89 37.85,41.02 37.85,46.35 37.33,46.87 DZ3.2 36.96,50.04 U$6.GND@0 U$6.GND@1 | R20.1 v30.61,5.33 | R18.1 34.25,6.9 33.66,7.49 32.77,7.49 v32.64,7.62 | C6.1 36.11,20.23 36.2,20.32 | Q5.2 37.65,9.84 v38.35,10.29 | Q6.2 37.74,13.46 v38.99,13.46 40,14.48 40,15.62 40.39,16 C7.1 | 36.2,20.32 36.83,20.95 v36.83,25.4 | 36.2,20.32 v36.96,19.94 | A2.3 33.4,31.88 34.54,31.88 35.31,31.11 35.31,30.35 34.54,29.59 | A4.3 34.54,29.59 | 34.54,29.59 35.31,28.83 35.31,27.94 34.67,27.3 | A1.3 34.67,27.3 | 34.67,27.3 35.31,26.67 35.31,25.65 v34.67,25.02 A3.3 | TOS.3 26.8,26.42 v26.29,26.42 | C1.2 27.09,28.32 v26.04,28.32 | Q1.2 28.38,9.84 28.96,10.41 30.61,10.41 31.24,9.78 31.24,8.42 R5.1
  Top 0.406: R5.1 32.38,7.87 v32.64,7.62 | LED1.C 80.01,27.1 U$1.P$2 | C5.1 12.57,34.76 v12.57,35.31
  Top 0.61: IC1.2 5.08,39.57 v5.08,40.77 | U$2.2 4.45,51.31 | U$2.1 4.45,51.31 | 4.45,51.31 5.08,50.67 v5.08,50.55
  Top 0.813: R13.1 41.74,10.16 | 41.74,10.16 R10.1 | Q5.2 41.42,9.84 41.74,10.16
  Bottom 0.203: v31.75,40.26 v34.29,40.26 v36.96,40.26 | v30.61,5.33 30.61,5.84 | v38.35,10.29 38.1,11.3 38.99,12.19 v38.99,13.46 | v36.96,19.94 37.34,19.68 | v36.83,25.4 36.45,25.02 v34.67,25.02 | v26.29,26.42 26.04,27.18 v26.04,28.32 25.27,27.56 v26.29,26.42
  Bottom 0.406: v32.64,7.62 32.64,6.35 | U$4.V- 63.75,13.02 | v12.57,35.31 12.32,35.56 12.32,36.45
  Bottom 0.61: 61.59,8.64 61.59,0.76 51.69,0.76 U$6.GND@2 | v5.08,40.77 4.7,41.15 4.7,41.91 | v5.08,50.55 5.84,49.78 6.22,49.78
  Bottom 0.813: CELL_CONNECTION.P$4 19.94,35.56 22.1,33.4 | 63.75,13.02 63.75,8.64 61.59,8.64
  pour Bottom: -2.29,-0.76 96.14,-0.38 96.27,53.85 -1.27,54.48
GPIO1  (via drill 0.6)
  Top 0.203: R23.2 35.9,17.23 v36.58,17.02 | v47.37,17.02 50.93,17.02 52.07,17.91 v56.39,17.91 | v56.64,25.4 59.18,25.4 60.58,26.8 62.74,26.8 U$4.GPIO1
  Bottom 0.203: v36.58,17.02 v47.37,17.02 | v56.39,17.91 56.64,17.91 56.77,18.03 56.77,25.27 v56.64,25.4
GPIO2  (via drill 0.6)
  Top 0.203: R21.2 38.48,18.5 v38.48,22.73 | v49.53,21.84 52.2,21.84 53.09,20.95 53.85,20.95 54.74,20.07 60.07,20.07 60.71,19.43 65.28,19.43 v65.41,19.56
  Bottom 0.203: v38.48,22.73 38.48,24.89 38.73,25.15 41.27,25.15 42.55,23.88 44.58,23.88 44.96,23.5 44.96,22.22 45.34,21.84 v49.53,21.84 | v65.41,19.56 65.41,24.13 65.28,24.26 62.74,24.26 U$4.GPIO2
MISO  (via drill 0.6)
  Top 0.203: v52.07,11.68 52.32,11.94 52.32,15.49 52.83,16 v52.96,16 | R22.1 46.61,6.69 v46.61,5.97
  Bottom 0.203: U$6.D12 v46.61,5.97 46.61,6.48 51.82,11.68 v52.07,11.68 | v52.96,16 57.28,16 57.53,16.26 57.53,27.56 56.83,28.26 U$4.SDO
MOSI  (via drill 0.6)
  Top 0.203: 64.39,32.89 v64.01,32.89 64.64,32.89 67.18,30.35 67.18,29.46 66.68,28.96 66.68,19.05 64.39,16.76 60.83,16.76 58.29,14.22 54.23,14.22 53.85,14.61 53.85,16.38 53.47,17.27 52.2,17.27 50.67,15.75 50.67,14.1 49.78,13.21 v49.78,11.68
  Bottom 0.203: U$6.D11 44.07,5.08 49.78,10.79 v49.78,11.68 | v64.01,32.89 59.56,32.89 58.74,32.07 U$4.SDI
N$1  (via drill 0.6)
  Top 0.203: Q5.3 35.31,8.85 35.31,9.14
  Top 0.305: R26.1 35.98,6.44 35.31,7.11 35.31,8.85 | 35.31,9.14 v34.8,9.65 | v26.8,13.08 26.8,13.97 Q10.4
  Bottom 0.305: v34.8,9.65 34.8,11.81 33.53,13.08 v26.8,13.08
N$2  (via drill 0.6)
  Top 0.203: Q2.2 47.5,41.07 47.5,38.48 46.74,37.72 38.99,37.72 37.97,38.73 36.07,38.73 35.56,39.24 26.58,39.24 25.57,38.23 R6.1
  Top 0.406: LED2.C U$3.P$2 | Q2.2 47.71,41.15 58.8,41.15 60.83,43.18 v64.9,43.18 | CELL_CONNECTION.P$3 24.17,39.37 R6.1
  Bottom 0.406: U$3.P$2 82.25,45.29 80.14,43.18 v64.9,43.18
N$3  (via drill 0.6)
  Top 0.203: LED3.C 84.85,46.86
  Top 0.406: U$5.P$2 88.52,43.19 LED3.C 84.58,44.58 v83.69,43.69 | v65.79,48.64 69.98,44.45 v69.98,41.02 | Q3.2 41.36,40.26 v43.69,40.26 | v52.07,43.18 53.09,44.2 v53.09,48.64 | CELL_CONNECTION.P$2 22.73,41.91 24,40.64 R3.1
  Bottom 0.406: v65.79,48.64 v53.09,48.64 15.37,48.64 13.97,47.24 13.97,43.31 15.37,41.91 CELL_CONNECTION.P$2 | v69.98,41.02 81.03,41.02 v83.69,43.69 | v43.69,40.26 44.2,40.77 44.2,42.29 45.09,43.18 v52.07,43.18
N$4  (via drill 0.6)
  Top 0.203: 29.12,38.35 R12.1 29.3,37.97 R7.1 26.5,35.81 25.91,35.81 25.27,36.45 v24.89,36.45
  Top 0.406: R8.1 24.77,42.93 19.43,42.93 CELL_CONNECTION.P$1
  Top 0.813: v39.24,44.7 40.46,44.7 Q8.2
  Bottom 0.203: 21.34,44.2 21.08,44.45 20.83,44.45 21.34,43.94 21.34,38.73 23.62,36.45 v24.89,36.45
  Bottom 0.813: CELL_CONNECTION.P$1 20.83,44.45 25.78,44.45 26.16,44.07 36.45,44.07 37.08,44.7 v39.24,44.7
N$5  (via drill 0.6)
  Top 0.406: R16.2 76.2,47.71 U$1.P$1 | v60.2,44.45 57.91,42.16 Q2.3
  Bottom 0.406: U$1.P$1 61.04,45.29 v60.2,44.45
N$7  (via drill 0.6)
  Top 0.203: R1.1 31.08,20.23 30.48,20.83 30.48,23.37 v29.97,23.88 | v44.45,38.61 46.1,38.61 46.74,39.24 46.74,42.93 46.92,43.11 Q2.1
  Bottom 0.203: v44.45,38.61 40.51,38.61 36.7,34.8 30.48,34.8 30.35,34.67 29.97,34.67 v29.97,23.88
N$8
  Top 0.61: Q10.5 26.04,18.41 24.77,18.41 | Q10.6 24.77,18.41 | 24.77,18.41 23.49,18.41 | Q10.7 23.49,18.41 | 23.49,18.41 22.22,18.41 22.22,18.54
  Top 0.813: D1.A Q10.8 22.22,18.54
N$10  (via drill 0.6)
  Top 0.406: v90.04,48.13 85.73,52.45 83.31,52.45 82.38,51.52 R17.2 82.3,51.56 81.41,52.45 55.24,52.45 45.85,43.05 43.64,43.05 Q3.3
  Bottom 0.406: v90.04,48.13 90.04,31.04 U$3.P$1
N$11  (via drill 0.6)
  Top 0.203: R2.1 27.9,19.98 27.3,20.57 27.3,22.99 27.05,23.24 24.89,23.24 23.24,24.89 v23.24,30.61 | v39.62,42.8 40.34,42.8 Q3.1
  Bottom 0.203: v39.62,42.8 39.24,42.42 39.24,38.48 36.58,35.81 27.43,35.81 26.67,35.05 23.49,35.05 23.24,34.8 v23.24,30.61
N$12  (via drill 0.6)
  Top 0.406: R19.2 88.52,47.59 U$5.P$1 | v47.5,46.86 44.2,46.86 43.05,45.72 Q8.3
  Bottom 0.406: U$5.P$1 88.52,47.59 83.91,52.2 72.01,52.2 66.68,46.86 v47.5,46.86
N$13
  Top 0.305: LED1.A R16.1
N$15  (via drill 0.6)
  Top 0.813: D2.C 10.11,30.73 v3.3,30.73
  Bottom 0.813: v3.3,30.73 2.29,30.73 1.65,30.1 1.65,20.7 X1.4
N$16
  Top 0.813: D3.C 13.08,20.7 5.33,12.95 X1.5
N$18  (via drill 0.6)
  Top 0.203: Q4.3 29.97,22.61 29.21,23.37 27.94,23.37 27.56,23.75 25.4,23.75 24.26,24.89 v24.26,29.46 | v24.26,33.15 24.26,33.74 R7.2
  Bottom 0.203: v24.26,29.46 v24.26,33.15
N$20
  Top 0.203: Q4.1 29.02,11.71 R11.1 28.23,10.92 26.67,10.92 25.19,9.44 Q1.3
N$22
  Top 0.305: LED2.A R17.1
N$23
  Top 0.305: LED3.A R19.1
N$29  (via drill 0.6)
  Top 0.203: R4.1 v33.53,37.72 | v38.48,40.26 38.48,45.72 39.69,46.67 Q8.1
  Bottom 0.203: v33.53,37.72 34.8,38.99 37.85,38.99 38.48,39.62 v38.48,40.26
PWR  (via drill 0.6)
  Top 0.203: Q1.1 28.93,7.94 R5.2 28.99,8.67 v29.97,9.65
  Bottom 0.203: v29.97,9.65 29.97,9.02 29.21,8.25 29.21,3.43 U$6.D6
S1  (via drill 0.6)
  Top 0.203: R1.2 32.93,22.99 v33.78,22.99 | v58.93,37.46 v48.89,37.46 | v43.43,31.88 41.27,29.72 41.27,25.27 39.75,23.75 v37.72,23.75
  Bottom 0.203: v33.78,22.99 36.96,22.99 v37.72,23.75 | v58.93,37.46 64.9,37.46 70.61,31.75 70.61,22.22 65.15,16.76 62.99,16.76 62.61,16.38 62.61,14.1 61.53,13.02 U$4.S1 | v48.89,37.46 43.43,32 v43.43,31.88
S2  (via drill 0.6)
  Top 0.203: R2.2 28.99,21.68 29.34,21.34 29.34,17.4 v28.7,16.76
  Bottom 0.203: U$4.S2 54.86,14.35 44.96,14.35 42.8,16.51 38.23,16.51 36.7,14.99 29.08,14.99 28.7,15.37 v28.7,16.76
S3  (via drill 0.6)
  Top 0.203: v51.56,15.37 51.12,14.67 U$4.S3 | v54.99,27.05 v54.99,31.75 | v52.58,36.58 44.7,36.58 44.2,37.08 38.1,37.08 37.46,37.72 R4.2
  Bottom 0.203: v51.56,15.37 51.44,22.86 54.99,26.42 v54.99,27.05 | v54.99,31.75 54.99,34.16 v52.58,36.58
SCK
  Bottom 0.203: U$6.D13 49.15,7.62 53.21,11.68 54.61,11.68 55.5,10.79 59.69,10.79 59.94,11.05 59.94,27.69 59.37,28.26 U$4.SCKI
SCL  (via drill 0.6)
  Top 0.203: U$6.SCL R9.1 | v50.29,6.35 50.29,5.59 48.64,3.94 43.56,3.94 v41.66,5.84 | v42.29,14.22 42.29,19.81 v42.04,19.81
  Bottom 0.203: v42.29,14.22 42.16,6.35 v41.66,5.84 | v50.29,6.35 57.53,6.35 59.31,4.57 U$6.SCL | v42.04,19.81 41.27,19.81 40.13,20.95 33.02,20.95 31.88,22.1 29.34,22.1 28.57,22.86 19.18,22.86 I2C.P$2
SDA  (via drill 0.6)
  Top 0.203: U$6.SDA R15.1 54.7,8.04 v54.1,8.64 | v53.98,10.79 53.72,10.54 51.31,10.54 49.53,8.76 46.48,8.76 46.1,8.38 46.1,6.98 45.47,6.35 44.83,6.35 43.69,7.49 43.69,12.95 43.18,13.84 43.18,15.11 42.67,15.62 42.67,19.05 42.8,19.18 42.8,20.32 v41.27,21.84
  Bottom 0.203: v54.1,8.64 54.1,10.67 v53.98,10.79 | v41.27,21.84 33.02,21.84 32.38,22.48 32.26,22.48 32,22.73 29.46,22.73 26.8,25.4 19.18,25.4 I2C.P$1
SS  (via drill 0.6)
  Top 0.203: 56.2,31.18 U$4.CSBI 56.2,32.45 55.63,33.15 47.24,33.15 46.23,32 45.59,32 44.07,30.48 44.07,26.54 43.18,25.65 43.18,15.62 43.69,15.11 43.69,14.48 v44.32,13.84
  Bottom 0.203: U$6.D10 41.53,3.56 43.81,5.84 43.81,7.49 44.32,8 v44.32,13.84
TOS  (via drill 0.6)
  Top 0.203: TOS.2 28.07,27.18 27.94,27.3 25.27,27.3 25.15,27.43 v25.15,30.86 | v42.04,35.94 40.77,35.94 39.37,34.67 28.83,34.67 27.56,33.4 v26.04,33.4 | U$4.TOS 60.96,20.95 v55.12,20.95 | v53.47,23.37 49.78,27.05 v45.34,27.05 | v40.51,31.75 v42.04,33.27
  Bottom 0.203: v25.15,30.86 25.27,30.99 25.15,31.11 25.15,32.51 v26.04,33.4 | v55.12,20.95 53.47,22.61 v53.47,23.37 | v45.34,27.05 44.07,28.19 39.12,28.19 38.73,28.57 38.73,30.23 40.13,31.62 v40.51,31.75 | v42.04,33.27 v42.04,35.94
V+  (via drill 0.6)
  Top 0.203: R11.2 30.7,13.89 arc-90 Q4.2 30.92,17.08 33.27,19.43 33.27,20.03 C6.2 36.07,22.82 36.07,29.34 36.45,29.72 v40.26,29.72 | v47.5,29.59 52.45,29.59 U$4.V+
  Bottom 0.203: v40.26,29.72 v47.5,29.59
VREF  (via drill 0.6)
  Top 0.203: U$4.VREF 59.94,19.43 v49.4,19.43 | v41.53,17.78 41.06,18.5 C7.2
  Bottom 0.203: v49.4,19.43 v45.34,19.43 44.32,17.78 v41.53,17.78
VREG  (via drill 0.6)
  Top 0.203: C1.1 28.96,28.41 TOS.1 31.5,26.04 | 31.5,26.04 A3.1 31.5,24.13 v31.24,23.88 | 31.5,26.04 A1.1 A4.1 A2.1 31.5,31.75 R14.2 | v50.29,24.26 53.09,21.97 62.48,21.97 U$4.VREG
  Bottom 0.203: v31.24,23.88 36.58,23.88 38.35,25.65 41.78,25.65 42.93,24.26 v50.29,24.26
VTEMP1
  Top 0.203: R14.1 26.92,32.04 28.92,34.04 40,34.04 41.02,35.05 63.37,35.05 68.07,30.35 68.07,19.81 U$4.VTEMP1
  Top 0.305: 27.09,31.88 R14.1 23.88,31.75 22.86,32.77 THERM.P$1
  Top 0.406: C5.2 13.3,32.77 THERM.P$1
WDTB  (via drill 0.6)
  Top 0.203: R25.2 33.02,17.65 v33.78,18.54 | v50.16,25.53 49.02,24.38 47.62,24.38 47.37,24.13 47.37,22.22 46.86,21.72 45.09,21.72 v44.7,21.21 | v51.44,26.8 51.44,26.29 53.21,24.51 53.98,24.51 55.24,23.24 61.21,23.24 U$4.WDTB
  Bottom 0.203: v33.78,18.54 43.18,18.54 43.43,18.8 43.43,19.81 v44.7,21.21 | v50.16,25.53 v51.44,26.8

### Text on the board
tPlace: C3 | C2 | C1 | C0 | 1 | 0 | BATT+ | GND | SDA | 0 | 1 | 1 | 0 | SCL | CHGR / IN | 12Vo / REG | 12Vo / UNREG | ESTOP1 | ESTOP2
bNames: ITEST BMS Rev 6